# EAGLE schematic gpio_unit (EAGLE 9.5.2)
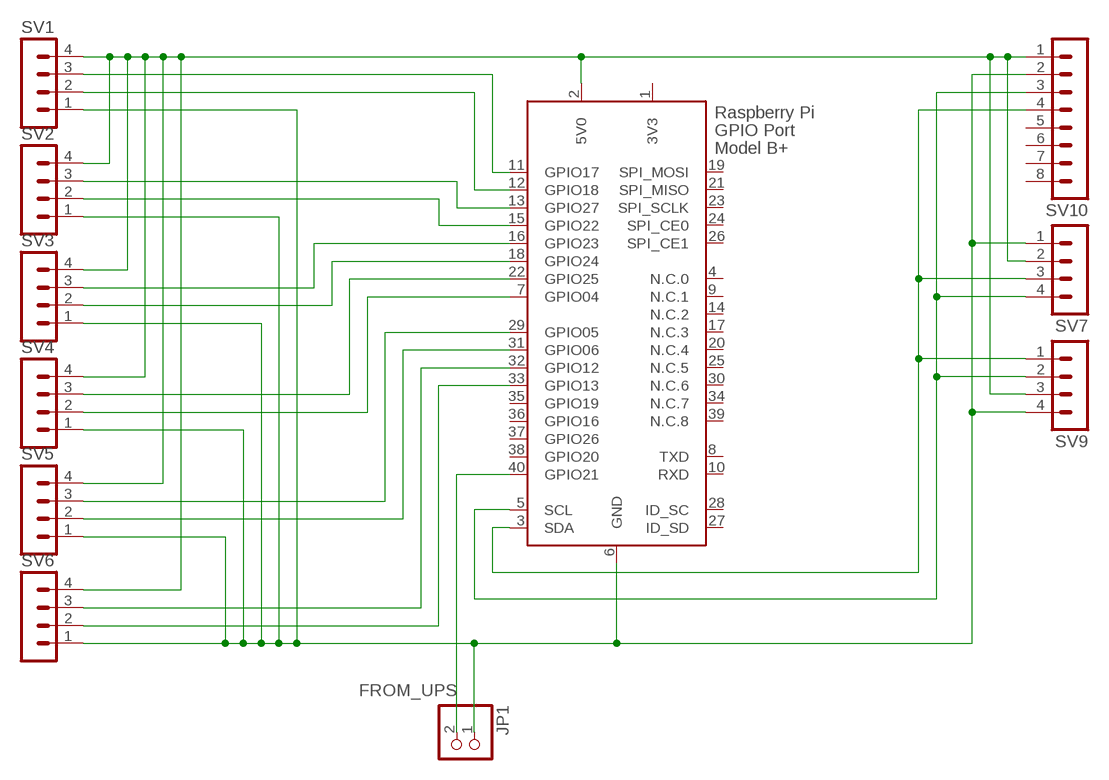
[diagram p0: schematic, sheet 1]

## Parts
JP1  PINHD-1X2  [1X02]
SV1  MA04-1  [MA04-1]
SV2  MA04-1  [MA04-1]
SV3  MA04-1  [MA04-1]
SV4  MA04-1  [MA04-1]
SV5  MA04-1  [MA04-1]
SV6  MA04-1  [MA04-1]
SV7  MA04-1  [MA04-1]
SV9  MA04-1  [MA04-1]
SV10  MA08-1  [MA08-1]
X1  RASPI_GPIO_B+_PIN  [RASPI_GPIO_B+_PIN]

## Nets
FROM_UPS: JP1.2 X1.40(GPIO21)
N$1: JP1.1 SV1.1 SV2.1 SV3.1 SV4.1 SV5.1 SV6.1 SV7.1 SV9.4 SV10.2 X1.6(GND)
N$2: SV1.3 X1.11(GPIO17)
N$3: SV1.2 X1.12(GPIO18)
N$4: SV2.3 X1.13(GPIO27)
N$5: SV7.4 SV9.2 SV10.3 X1.5(SCL)
N$6: SV2.2 X1.15(GPIO22)
N$7: SV3.3 X1.16(GPIO23)
N$8: SV3.2 X1.18(GPIO24)
N$9: SV4.3 X1.22(GPIO25)
N$10: SV4.2 X1.7(GPIO04)
N$11: SV5.3 X1.29(GPIO05)
N$12: SV5.2 X1.31(GPIO06)
N$13: SV6.3 X1.32(GPIO12)
N$14: SV6.2 X1.33(GPIO13)
N$15: SV7.3 SV9.1 SV10.4 X1.3(SDA)
VDD: SV1.4 SV2.4 SV3.4 SV4.4 SV5.4 SV6.4 SV7.2 SV9.3 SV10.1 X1.2(5V0)
Unconnected: SV10.5 SV10.6 SV10.7 SV10.8 X1.4(N.C.0) X1.8(TXD) X1.9(N.C.1) X1.10(RXD) X1.14(N.C.2) X1.17(N.C.3) X1.19(SPI_MOSI) X1.20(N.C.4) X1.21(SPI_MISO) X1.23(SPI_SCLK) X1.24(SPI_CE0) X1.25(N.C.5) X1.26(SPI_CE1) X1.27(ID_SD) X1.28(ID_SC) X1.30(N.C.6) X1.34(N.C.7) X1.35(GPIO19) X1.36(GPIO16) X1.37(GPIO26) X1.38(GPIO20) X1.39(N.C.8)

## Power pins joined to a net without a drawn wire
3V3: X1.1(3V3)

## Library data of the parts
JP1 = pinhead:PINHD-1X2: PIN HEADER
SV1-SV7 SV9 = con-lstb:MA04-1: PIN HEADER; OC_FARNELL: unknown; OC_NEWARK: unknown
SV10 = con-lstb:MA08-1: PIN HEADER; OC_FARNELL: unknown; OC_NEWARK: unknown
X1 = raspberrypi_bastelstube_v13:RASPI_GPIO_B+: Only the 2x20 header connector, nothing else

## Net classes
0 default: width 0.127 mm, clearance 0.127 mm